# Altium project ETRX_FECU.PrjPcb
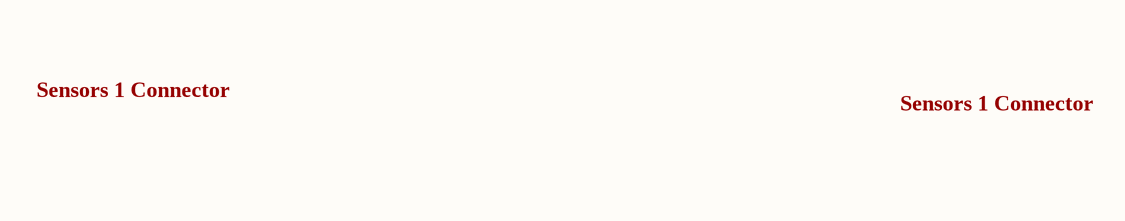
[diagram p0: ETRX_FECU.SchDoc, left]
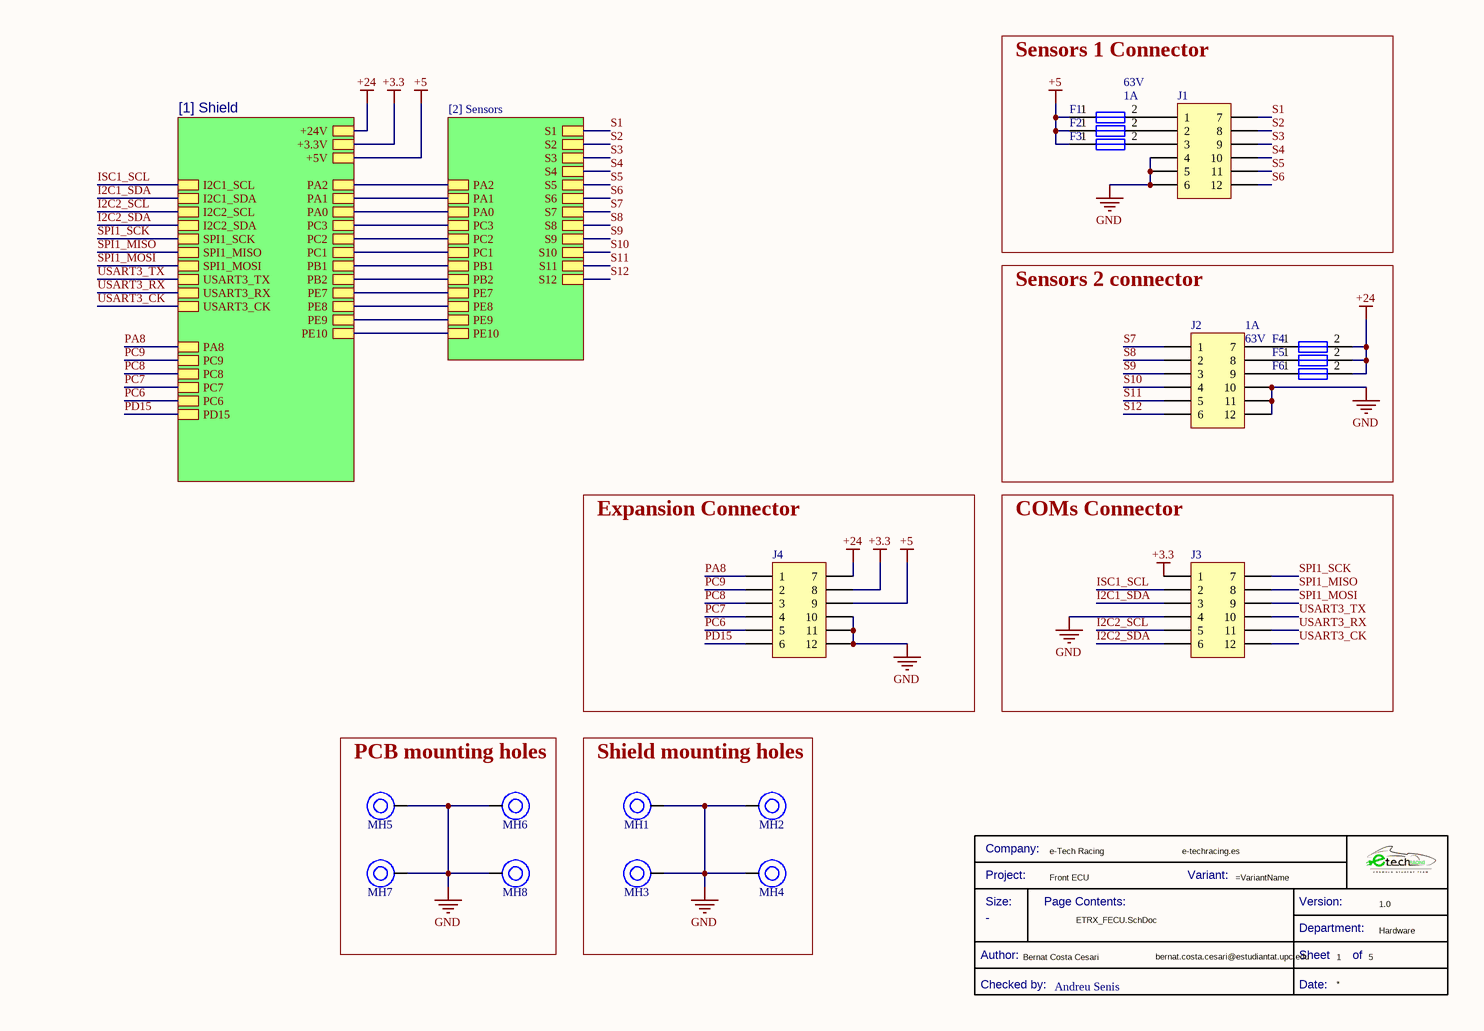
[diagram p1: ETRX_FECU.SchDoc, right]
Company: e-Tech Racing; Department: Hardware; DesignedByURL: e-techracing.es; DesignerMail: bernat.costa.cesari@estudiantat.upc.edu; DesignerName: Bernat Costa Cesari; Project: Front ECU; ReviewerName: Andreu Senis; Version: 1.0
3 sheets, 58 parts. Net scope: hierarchical (ports join the sheet entries above them; power ports are global).
Board file: ETRX_FECU.PcbDoc
Sheets:
  ETRX_FECU.SchDoc
    [1] Shield = [1] Shield.SchDoc
    [2] Sensors = [2] Sensors.SchDoc

## Sheet ETRX_FECU.SchDoc
size A4; DocumentNumber: 1; SheetNumber: 1; SheetTotal: 5

### Parts
(Parts that share a designator on the sheet are numbered #1, #2 ... from top to bottom, then left to right.)
*#1  Checked by:: Andreu Senis  (hidden comment: Title Block_template)  (graphical)
F1  Current Rating: 1A  Voltage Rating (DC): 63V  [Fuse_1206]  (hidden comment: 0437001.WRA)
F2  0437001.WRA  [Fuse_1206]  (value not drawn)
F3  0437001.WRA  [Fuse_1206]  (value not drawn)
F4  Current Rating: 1A  Voltage Rating (DC): 63V  [Fuse_1206]  (hidden comment: 0437001.WRA)
F5  0437001.WRA  [Fuse_1206]  (value not drawn)
F6  0437001.WRA  [Fuse_1206]  (value not drawn)
J1  1053101112  [J_NanoFit_2x6_V]  (value not drawn)
J2  1053101112  [J_NanoFit_2x6_V]  (value not drawn)
J3  1053101112  [J_NanoFit_2x6_V]  (value not drawn)
J4  1053101112  [J_NanoFit_2x6_V]  (value not drawn)
MH1  Mounting_Hole_M3  [Mounting_Hole_M3]  (value not drawn)
MH2  Mounting_Hole_M3  [Mounting_Hole_M3]  (value not drawn)
MH3  Mounting_Hole_M3  [Mounting_Hole_M3]  (value not drawn)
MH4  Mounting_Hole_M3  [Mounting_Hole_M3]  (value not drawn)
MH5  Mounting_Hole_M4  [Mounting_Hole_M4]  (value not drawn)
MH6  Mounting_Hole_M4  [Mounting_Hole_M4]  (value not drawn)
MH7  Mounting_Hole_M4  [Mounting_Hole_M4]  (value not drawn)
MH8  Mounting_Hole_M4  [Mounting_Hole_M4]  (value not drawn)

### Blocks framed on the sheet
Sensors 1 Connector: F1-F3 J1
Sensors 2 connector: F4-F6 J2
Expansion Connector: J4
COMs Connector: J3
PCB mounting holes: MH5-MH8
Shield mounting holes: MH1-MH4

### Sub-sheets
[1] Shield = [1] Shield: +24V, +3.3V, +5V, I2C1_SCL, I2C1_SDA, I2C2_SCL, I2C2_SDA, SPI1_SCK, SPI1_MISO, SPI1_MOSI, USART3_TX, USART3_RX, USART3_CK, PA2, PA1, PA0, PC3, PC2, PC1, PB1, PB2, PE7, PE8, PE9, PE10, PA8, PC9, PC8, PC7, PC6, PD15
[2] Sensors = [2] Sensors: PA2, PA1, PA0, PC3, PC2, PC1, PB1, PB2, PE7, PE8, PE9, PE10, S1, S2, S3, S4, S5, S6, S7, S8, S9, S10, S11, S12

### Nets
+3.3: J3.1 J4.8 ; sheet [1] Shield/+3.3V
+5: F1.1 F2.1 F3.1 J4.9 ; sheet [1] Shield/+5V
+24: F4.2 F5.2 F6.2 J4.7 ; sheet [1] Shield/+24V  [project net LV tr]
GND: J1.4 J1.5 J1.6 J2.10 J2.11 J2.12 J3.4 J4.10 J4.11 J4.12 MH1.1 MH2.1 MH3.1 MH4.1 MH5.1 MH6.1 MH7.1 MH8.1
I2C1_SDA: J3.3 ; sheet [1] Shield/I2C1_SDA
I2C2_SCL: J3.5 ; sheet [1] Shield/I2C2_SCL
I2C2_SDA: J3.6 ; sheet [1] Shield/I2C2_SDA
ISC1_SCL: J3.2 ; sheet [1] Shield/I2C1_SCL
PA0: sheet [1] Shield/PA0, sheet [2] Sensors/PA0
PA1: sheet [1] Shield/PA1, sheet [2] Sensors/PA1
PA2: sheet [1] Shield/PA2, sheet [2] Sensors/PA2
PA8: J4.1 ; sheet [1] Shield/PA8
PB1: sheet [1] Shield/PB1, sheet [2] Sensors/PB1
PB2: sheet [1] Shield/PB2, sheet [2] Sensors/PB2
PC1: sheet [1] Shield/PC1, sheet [2] Sensors/PC1
PC2: sheet [1] Shield/PC2, sheet [2] Sensors/PC2
PC3: sheet [1] Shield/PC3, sheet [2] Sensors/PC3
PC6: J4.5 ; sheet [1] Shield/PC6
PC7: J4.4 ; sheet [1] Shield/PC7
PC8: J4.3 ; sheet [1] Shield/PC8
PC9: J4.2 ; sheet [1] Shield/PC9
PD15: J4.6 ; sheet [1] Shield/PD15
PE7: sheet [1] Shield/PE7, sheet [2] Sensors/PE7
PE8: sheet [1] Shield/PE8, sheet [2] Sensors/PE8
PE9: sheet [1] Shield/PE9, sheet [2] Sensors/PE9
PE10: sheet [1] Shield/PE10, sheet [2] Sensors/PE10
S1: J1.7 ; sheet [2] Sensors/S1
S2: J1.8 ; sheet [2] Sensors/S2
S3: J1.9 ; sheet [2] Sensors/S3
S4: J1.10 ; sheet [2] Sensors/S4
S5: J1.11 ; sheet [2] Sensors/S5
S6: J1.12 ; sheet [2] Sensors/S6
S7: J2.1 ; sheet [2] Sensors/S7
S8: J2.2 ; sheet [2] Sensors/S8
S9: J2.3 ; sheet [2] Sensors/S9
S10: J2.4 ; sheet [2] Sensors/S10
S11: J2.5 ; sheet [2] Sensors/S11
S12: J2.6 ; sheet [2] Sensors/S12
SPI1_MISO: J3.8 ; sheet [1] Shield/SPI1_MISO  [project net PA6]
SPI1_MOSI: J3.9 ; sheet [1] Shield/SPI1_MOSI  [project net PA7]
SPI1_SCK: J3.7 ; sheet [1] Shield/SPI1_SCK  [project net PA5]
USART3_CK: J3.12 ; sheet [1] Shield/USART3_CK  [project net PD10]
USART3_RX: J3.11 ; sheet [1] Shield/USART3_RX  [project net PD9]
USART3_TX: J3.10 ; sheet [1] Shield/USART3_TX  [project net PD8]
NetF1_2: F1.2 J1.1
NetF2_2: F2.2 J1.2
NetF3_2: F3.2 J1.3
NetF4_1: F4.1 J2.7
NetF5_1: F5.1 J2.8
NetF6_1: F6.1 J2.9

### Notes on the sheet
- Sensors 1 Connector
- (in symbol Title Block_template) Company:; Project:; Variant:; Size:; Page Contents:; Version:; Department:; Author:; Sheet; of; Checked by:; Date:

### Library data of the parts
*#1 = Title Block_template: Standard Title Block; .Creator: GP; Category: Title Block; .PCBcheck: GP; .SCHcheck: GP; Size: -
F1-F6 = Fuse_1A_63V_1206: Fuse Chip Fast Acting 1A 63V SMD Solder Pad 1206 Ceramic T/R Automotive; Manufacturer: Littelfuse; Fuse Type: Board Mount (Cartridge Style Excluded); Approvals: CSA,cURus; .Creator: DO; Supplier 1: Digi-Key; Manufacturer Part Number: 0437001.WRA; RoHS: Yes; Category: Fuses; Stock 1: 5820; Pricing 1: 1=1,52000, 5=1,47000, 10=1,37600, 50=1,13860, 100=0,94880, 250=0,92508, 500=0,78276, 1000=0,68788 (USD); Mount: Surface Mount; Case/Package: 1206; Case Code (Imperial): 1206; Case Code (Metric): 3216; Min Operating Temperature: -55°C; Max Operating Temperature: 150°C; Packaging: Tape and Reel; Voltage Rating (AC): 63V; ComponentLink1URL: https://www.littelfuse.com/~/media/electronics/datasheets/fuses/littelfuse_fuse_437a_datasheet.pdf.pdf?src-supplier=Digi-Key; ComponentLink1Description: https://www.littelfuse.com/~/media/electronics/datasheets/fuses/littelfuse_fuse_437a_datasheet.pdf.pdf?src-supplier=Digi-Key; Supplier Part Number 1: F10001CT-ND; ComponentLink2Description: Where buy it; ComponentLink2URL: https://www.mouser.es/ProductDetail/Littelfuse/0437001WRA?qs=DXv0QSHKF4z9CJhPXjxR%252BA%3D%3D
  F2 F3 F5 F6: Current Rating: 1A; Voltage Rating (DC): 63V
J1-J4 = J_NanoFit_2x6_V: Nano-Fit Vertical Header, Through Hole, 2.50mm Pitch, Dual Row, 12 Circuits, with Kinked Pins, Tin (Sn) Plating, Black, Glow-Wire Capable, Tray

## Sheet [1] Shield.SchDoc
size A4; DocumentNumber: 2; SheetNumber: 2; SheetTotal: 5
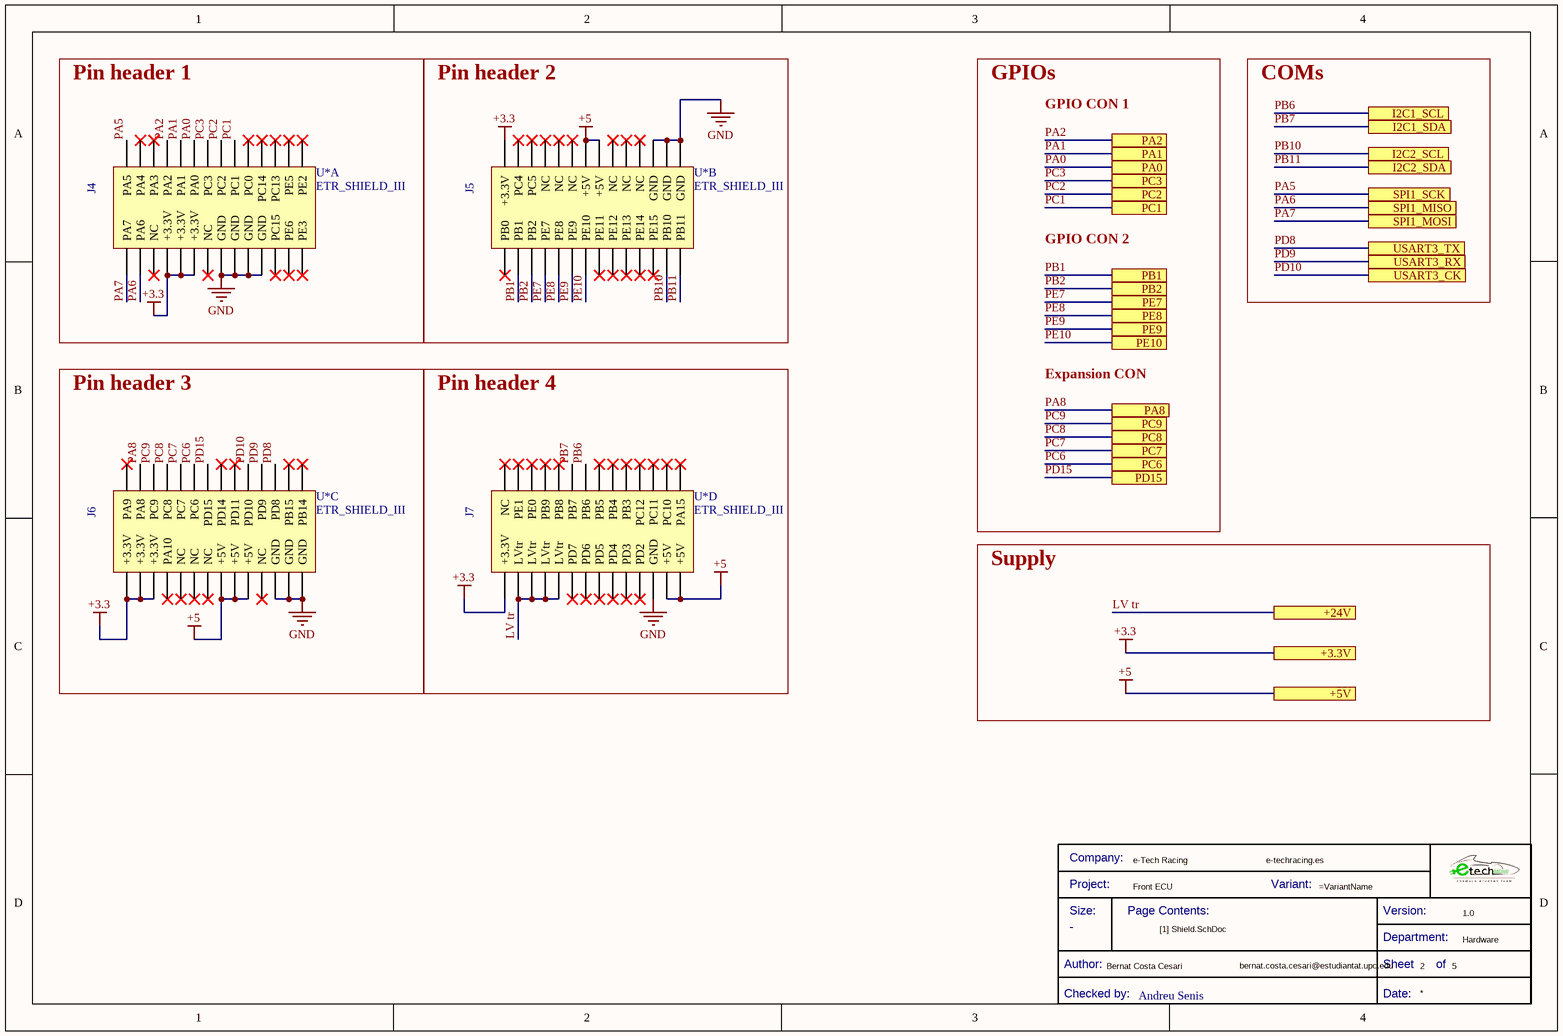
[diagram p2: [1] Shield.SchDoc]

### Parts
(Parts that share a designator on the sheet are numbered #1, #2 ... from top to bottom, then left to right.)
*#2  Checked by:: Andreu Senis  (hidden comment: Title Block_template)  (graphical)
U*  ETR_SHIELD_III  [ETR_SHIELD_III]  (parts A,B,C,D of 4)

### Blocks framed on the sheet
Pin header 1: U*
Pin header 2: U*
Pin header 3: U*
Pin header 4: U*

### Ports
+3.3V (see ETRX_FECU[2A]), +5V (see ETRX_FECU[2A]), +24V (see ETRX_FECU[2A]), I2C1_SCL (see ETRX_FECU[1A]), I2C1_SDA (see ETRX_FECU[1A]), I2C2_SCL (see ETRX_FECU[1A]), I2C2_SDA (see ETRX_FECU[1A]), PA0 (see ETRX_FECU[2A], [2] Sensors[1A]), PA1 (see ETRX_FECU[2A], [2] Sensors[1A]), PA2 (see ETRX_FECU[2A], [2] Sensors[1A]), PA8 (see ETRX_FECU[1B]), PB1 (see ETRX_FECU[2B], [2] Sensors[1A]), PB2 (see ETRX_FECU[2B], [2] Sensors[1A]), PC1 (see ETRX_FECU[2B], [2] Sensors[1A]), PC2 (see ETRX_FECU[2A], [2] Sensors[1A]), PC3 (see ETRX_FECU[2A], [2] Sensors[1A]), PC6 (see ETRX_FECU[1B]), PC7 (see ETRX_FECU[1B]), PC8 (see ETRX_FECU[1B]), PC9 (see ETRX_FECU[1B]), PD15 (see ETRX_FECU[1B]), PE7 (see ETRX_FECU[2B], [2] Sensors[1A]), PE8 (see ETRX_FECU[2B], [2] Sensors[1B]), PE9 (see ETRX_FECU[2B], [2] Sensors[1B]), PE10 (see ETRX_FECU[2B], [2] Sensors[1B]), SPI1_MISO (see ETRX_FECU[1B]), SPI1_MOSI (see ETRX_FECU[1B]), SPI1_SCK (see ETRX_FECU[1A]), USART3_CK (see ETRX_FECU[1B]), USART3_RX (see ETRX_FECU[1B]), USART3_TX (see ETRX_FECU[1B])

### Nets
+3.3: U*.3V3_1(+3.3V) U*.3V3_2(+3.3V) U*.3V3_3(+3.3V) U*.3V3_4(+3.3V) U*.3V3_5(+3.3V) U*.3V3_6(+3.3V) U*.3V3_7(+3.3V) U*.3V3_8(+3.3V) ; port +3.3V
+5: U*.5V_1(+5V) U*.5V_2(+5V) U*.5V_3(+5V) U*.5V_4(+5V) U*.5V_5(+5V) U*.5V_6(+5V) U*.5V_7(+5V) ; port +5V
GND: U*.GND_1(GND) U*.GND_2(GND) U*.GND_3(GND) U*.GND_4(GND) U*.GND_5(GND) U*.GND_6(GND) U*.GND_7(GND) U*.GND_8(GND) U*.GND_9(GND) U*.GND_10(GND) U*.GND_11(GND)
LV tr: U*.LVtr_1(LVtr) U*.LVtr_2(LVtr) U*.LVtr_3(LVtr) U*.LVtr_4(LVtr) ; port +24V
PA0: U*.PA0 ; port PA0
PA1: U*.PA1 ; port PA1
PA2: U*.PA2 ; port PA2
PA5: U*.PA5 ; port SPI1_SCK
PA6: U*.PA6 ; port SPI1_MISO
PA7: U*.PA7 ; port SPI1_MOSI
PA8: U*.PA8 ; port PA8
PB1: U*.PB1 ; port PB1
PB2: U*.PB2 ; port PB2
PB6: U*.PB6 ; port I2C1_SCL  [project net ISC1_SCL]
PB7: U*.PB7 ; port I2C1_SDA  [project net I2C1_SDA]
PB10: U*.PB10 ; port I2C2_SCL  [project net I2C2_SCL]
PB11: U*.PB11 ; port I2C2_SDA  [project net I2C2_SDA]
PC1: U*.PC1 ; port PC1
PC2: U*.PC2 ; port PC2
PC3: U*.PC3 ; port PC3
PC6: U*.PC6 ; port PC6
PC7: U*.PC7 ; port PC7
PC8: U*.PC8 ; port PC8
PC9: U*.PC9 ; port PC9
PD8: U*.PD8 ; port USART3_TX
PD9: U*.PD9 ; port USART3_RX
PD10: U*.PD10 ; port USART3_CK
PD15: U*.PD15 ; port PD15
PE7: U*.PE7 ; port PE7
PE8: U*.PE8 ; port PE8
PE9: U*.PE9 ; port PE9
PE10: U*.PE10 ; port PE10

Not connected (* = marked no-connect by the designer): U* NC_1(NC)* NC_2(NC)* NC_3(NC)* NC_4(NC)* NC_5(NC)* NC_6(NC)* NC_7(NC)* NC_8(NC)* NC_9(NC)* NC_10(NC)* NC_11(NC)* NC_12(NC)* NC_13(NC)* PA3* PA4* PA9* PA10* PA15* PB0* PB3* PB4* PB5* PB8* PB9* PB14* PB15* PC0* PC4* PC5* PC10* PC11* PC12* PC13* PC14* PC15* PD2* PD3* PD4* PD5* PD6* PD7* PD11* PD14* PE0* PE1* PE2* PE3* PE5* PE6* PE11* PE12* PE13* PE14* PE15*

### Notes on the sheet
- GPIOs
- GPIO CON 1
- COMs
- GPIO CON 2
- Expansion CON
- Supply
- (in symbol ETR_Shield_III, part A) J4
- (in symbol ETR_Shield_III, part B) J5
- (in symbol ETR_Shield_III, part C) J6
- (in symbol ETR_Shield_III, part D) J7
- (in symbol Title Block_template) Company:; Project:; Variant:; Size:; Page Contents:; Version:; Department:; Author:; Sheet; of; Checked by:; Date:

### Library data of the parts
*#2 = Title Block_template: Standard Title Block; .Creator: GP; Category: Title Block; .PCBcheck: GP; .SCHcheck: GP; Size: -

## Sheet [2] Sensors.SchDoc
size A4; DocumentNumber: 3; SheetNumber: 3; SheetTotal: 5
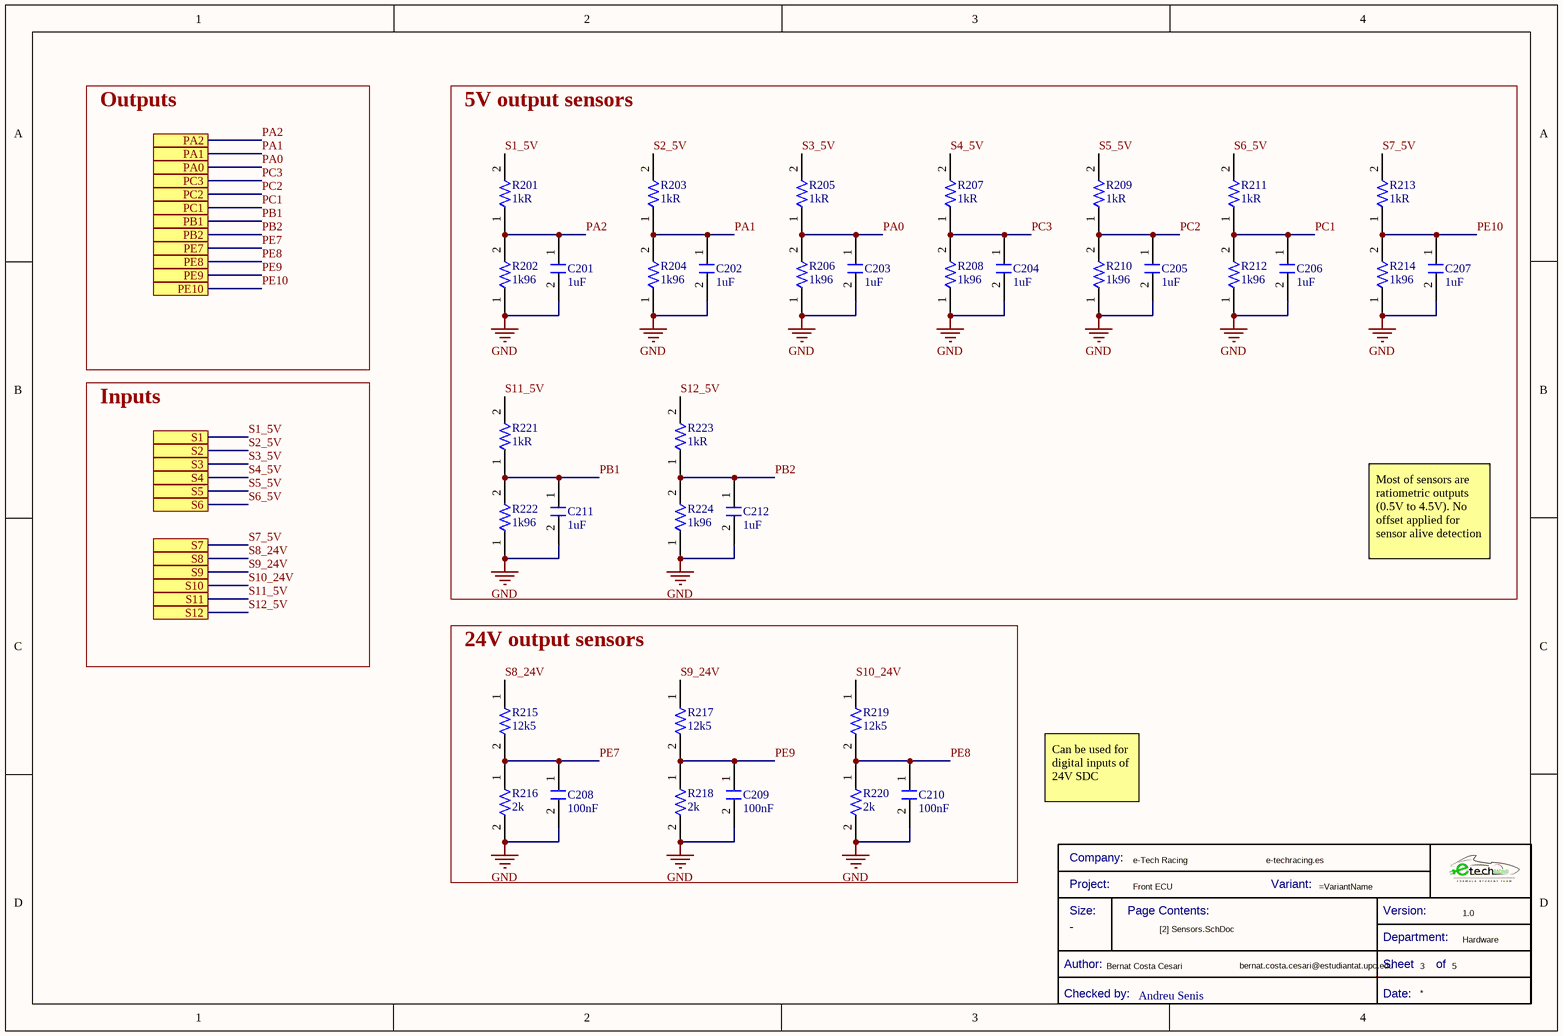
[diagram p3: [2] Sensors.SchDoc]

### Parts
(Parts that share a designator on the sheet are numbered #1, #2 ... from top to bottom, then left to right.)
*#3  Checked by:: Andreu Senis  (hidden comment: Title Block_template)  (graphical)
C201  Capacitance: 1uF  [C0805FNPC-R]  (hidden comment: 885012207103)
C202  Capacitance: 1uF  [C0805FNPC-R]  (hidden comment: 885012207103)
C203  Capacitance: 1uF  [C0805FNPC-R]  (hidden comment: 885012207103)
C204  Capacitance: 1uF  [C0805FNPC-R]  (hidden comment: 885012207103)
C205  Capacitance: 1uF  [C0805FNPC-R]  (hidden comment: 885012207103)
C206  Capacitance: 1uF  [C0805FNPC-R]  (hidden comment: 885012207103)
C207  Capacitance: 1uF  [C0805FNPC-R]  (hidden comment: 885012207103)
C208  Capacitance: 100nF  [C0805FNPC-R]  (hidden comment: 885012207098)
C209  Capacitance: 100nF  [C0805FNPC-R]  (hidden comment: 885012207098)
C210  Capacitance: 100nF  [C0805FNPC-R]  (hidden comment: 885012207098)
C211  Capacitance: 1uF  [C0805FNPC-R]  (hidden comment: 885012207103)
C212  Capacitance: 1uF  [C0805FNPC-R]  (hidden comment: 885012207103)
R201  Resistance: 1kR  [R0805FTK]  (hidden comment: CR0805-JW-102ELF)
R202  1k96  [R0805FTK]
R203  Resistance: 1kR  [R0805FTK]  (hidden comment: CR0805-JW-102ELF)
R204  1k96  [R0805FTK]
R205  Resistance: 1kR  [R0805FTK]  (hidden comment: CR0805-JW-102ELF)
R206  1k96  [R0805FTK]
R207  Resistance: 1kR  [R0805FTK]  (hidden comment: CR0805-JW-102ELF)
R208  1k96  [R0805FTK]
R209  Resistance: 1kR  [R0805FTK]  (hidden comment: CR0805-JW-102ELF)
R210  1k96  [R0805FTK]
R211  Resistance: 1kR  [R0805FTK]  (hidden comment: CR0805-JW-102ELF)
R212  1k96  [R0805FTK]
R213  Resistance: 1kR  [R0805FTK]  (hidden comment: CR0805-JW-102ELF)
R214  1k96  [R0805FTK]
R215  12k5  [R0805FTK]
R216  2k  [R0805FTK]
R217  12k5  [R0805FTK]
R218  2k  [R0805FTK]
R219  12k5  [R0805FTK]
R220  2k  [R0805FTK]
R221  Resistance: 1kR  [R0805FTK]  (hidden comment: CR0805-JW-102ELF)
R222  1k96  [R0805FTK]
R223  Resistance: 1kR  [R0805FTK]  (hidden comment: CR0805-JW-102ELF)
R224  1k96  [R0805FTK]

### Blocks framed on the sheet
5V output sensors: C201-C207 C211 C212 R201-R214 R221-R224
24V output sensors: C208-C210 R215-R220

### Ports
PA0 (see ETRX_FECU[2A], [1] Shield[3A]), PA1 (see ETRX_FECU[2A], [1] Shield[3A]), PA2 (see ETRX_FECU[2A], [1] Shield[3A]), PB1 (see ETRX_FECU[2B], [1] Shield[3B]), PB2 (see ETRX_FECU[2B], [1] Shield[3B]), PC1 (see ETRX_FECU[2B], [1] Shield[3A]), PC2 (see ETRX_FECU[2A], [1] Shield[3A]), PC3 (see ETRX_FECU[2A], [1] Shield[3A]), PE7 (see ETRX_FECU[2B], [1] Shield[3B]), PE8 (see ETRX_FECU[2B], [1] Shield[3B]), PE9 (see ETRX_FECU[2B], [1] Shield[3B]), PE10 (see ETRX_FECU[2B], [1] Shield[3B]), S1 (see ETRX_FECU[2A]), S2 (see ETRX_FECU[2A]), S3 (see ETRX_FECU[2A]), S4 (see ETRX_FECU[2A]), S5 (see ETRX_FECU[2A]), S6 (see ETRX_FECU[2A]), S7 (see ETRX_FECU[2A]), S8 (see ETRX_FECU[2A]), S9 (see ETRX_FECU[2A]), S10 (see ETRX_FECU[2B]), S11 (see ETRX_FECU[2B]), S12 (see ETRX_FECU[2B])

### Nets
GND: C201.2 C202.2 C203.2 C204.2 C205.2 C206.2 C207.2 C208.2 C209.2 C210.2 C211.2 C212.2 R202.1 R204.1 R206.1 R208.1 R210.1 R212.1 R214.1 R216.2 R218.2 R220.2 R222.1 R224.1
PA0: C203.1 R205.1 R206.2 ; port PA0
PA1: C202.1 R203.1 R204.2 ; port PA1
PA2: C201.1 R201.1 R202.2 ; port PA2
PB1: C211.1 R221.1 R222.2 ; port PB1
PB2: C212.1 R223.1 R224.2 ; port PB2
PC1: C206.1 R211.1 R212.2 ; port PC1
PC2: C205.1 R209.1 R210.2 ; port PC2
PC3: C204.1 R207.1 R208.2 ; port PC3
PE7: C208.1 R215.2 R216.1 ; port PE7
PE8: C210.1 R219.2 R220.1 ; port PE8
PE9: C209.1 R217.2 R218.1 ; port PE9
PE10: C207.1 R213.1 R214.2 ; port PE10
S1_5V: R201.2 ; port S1  [project net S1]
S2_5V: R203.2 ; port S2  [project net S2]
S3_5V: R205.2 ; port S3  [project net S3]
S4_5V: R207.2 ; port S4  [project net S4]
S5_5V: R209.2 ; port S5  [project net S5]
S6_5V: R211.2 ; port S6  [project net S6]
S7_5V: R213.2 ; port S7  [project net S7]
S8_24V: R215.1 ; port S8  [project net S8]
S9_24V: R217.1 ; port S9  [project net S9]
S10_24V: R219.1 ; port S10  [project net S10]
S11_5V: R221.2 ; port S11  [project net S11]
S12_5V: R223.2 ; port S12  [project net S12]

### Notes on the sheet
- Outputs
- Inputs
- Most of sensors are ratiometric outputs (0.5V to 4.5V). No offset applied for sensor alive detection
- Can be used for digital inputs of 24V SDC
- (in symbol Title Block_template) Company:; Project:; Variant:; Size:; Page Contents:; Version:; Department:; Author:; Sheet; of; Checked by:; Date:

### Library data of the parts
*#3 = Title Block_template: Standard Title Block; .Creator: GP; Category: Title Block; .PCBcheck: GP; .SCHcheck: GP; Size: -
C201-C207 C211 C212 = C1u-50V-0805FNPC-X7R: Multilayer Ceramic Capacitor, Wcap-Csgp Series, 1 F, 10%, X7R, 50 V, 0805 [2012 Metric] Rohs Compliant: Yes; Manufacturer 1: Wurth Electronics; Voltage Rating: 50V; .Creator: GP; Supplier 1: RSComponents; Manufacturer Part Number 1: 885012207103; RoHS: Yes; Category: Ceramic Capacitors; Stock 1: 5100; Pricing 1: 50=0,27200, 250=0,25300, 500=0,22800, 1250=0,20100, 2500=0,17100 (GBP); Mount: Surface Mount; Case/Package: 0805; Case Code (Metric): 2012; Case Code (Imperial): 0805; Min Operating Temperature: -55°C; Max Operating Temperature: 85°C; Packaging: Cut Tape; Dielectric: X7R; Tolerance: 10%; Voltage Rating (DC): 50V; Length: 0.079inch; Width: 0.049inch; Thickness: 0.053inch; REACH SVHC: Unknown; RoHS Compliant: Yes; ComponentLink1URL: http://www.farnell.com/datasheets/1958501.pdf?src-supplier=Farnell; ComponentLink1Description: http://www.farnell.com/datasheets/1958501.pdf?src-supplier=Farnell; ComponentLink2URL: http://www.farnell.com/datasheets/1958501.pdf?src-supplier=Element14; ComponentLink2Description: http://www.farnell.com/datasheets/1958501.pdf?src-supplier=Element14; ComponentLink3URL: https://katalog.we-online.de/pbs/datasheet/885012107003.pdf?src-supplier=Digi-Key; ComponentLink3Description: https://katalog.we-online.de/pbs/datasheet/885012107003.pdf?src-supplier=Digi-Key; ComponentLink4URL: http://www.farnell.com/datasheets/1958501.pdf?src-supplier=Newark; ComponentLink4Description: http://www.farnell.com/datasheets/1958501.pdf?src-supplier=Newark; Supplier Part Number 1: 1813523
C208-C210 = C100n-50V-0805FNPC-X7R: Cap, 0.1ΜF, 50V, 10%, X7R, 0805; Manufacturer 1: Wurth Electronics; .Creator: DR; Supplier 1: RSComponents; Manufacturer Part Number 1: 885012207098; RoHS: Yes; Category: Ceramic Capacitors; Stock 1: 8000; Pricing 1: 100=0,10200, 500=0,07100, 2000=0,06100 (GBP); Mount: Surface Mount; Case/Package: 0805; Case Code (Metric): 2012; Case Code (Imperial): 0805; Min Operating Temperature: -55°C; Max Operating Temperature: 125°C; Packaging: Cut Tape; Voltage Rating: 50V; Dielectric: X7R; Tolerance: 10%; Voltage Rating (DC): 50V; Length: 0.079inch; Width: 0.049inch; Thickness: 0.035inch; REACH SVHC: Unknown; RoHS Compliant: Yes; ComponentLink1URL: http://www.farnell.com/datasheets/1958498.pdf?src-supplier=Farnell; ComponentLink1Description: http://www.farnell.com/datasheets/1958498.pdf?src-supplier=Farnell; ComponentLink2URL: http://www.farnell.com/datasheets/1958498.pdf?src-supplier=Element14; ComponentLink2Description: http://www.farnell.com/datasheets/1958498.pdf?src-supplier=Element14; ComponentLink3URL: https://katalog.we-online.de/pbs/datasheet/885012207098.pdf?src-supplier=Digi-Key; ComponentLink3Description: https://katalog.we-online.de/pbs/datasheet/885012207098.pdf?src-supplier=Digi-Key; ComponentLink4URL: http://www.farnell.com/datasheets/1958498.pdf?src-supplier=Newark; ComponentLink4Description: http://www.farnell.com/datasheets/1958498.pdf?src-supplier=Newark; Supplier Part Number 1: 1813493
R201 R203 R205 R207 R209 R211 R213 R221 R223 = R1k-0805FTK: Res Thick Film 0805 1K Ohm 5% 1/8W ±200ppm/°C Molded SMD SMD Paper Tape on Plastic Reel; Manufacturer 1: Bourns; Voltage Rating (DC): 150V; Power Rating: 125mW; .Creator: GP; Supplier 1: Arrow Electronics; Manufacturer Part Number 1: CR0805-JW-102ELF; RoHS: Yes; Category: Chip SMD Resistors; Stock 1: 27510; Pricing 1: 1=0,05930, 10=0,03510, 25=0,01790, 100=0,00800, 250=0,00790, 500=0,00590, 1000=0,00360, 3000=0,00350, 6000=0,00250 (USD); Mount: Surface Mount; Case/Package: 0805; Number of Pins: 2; Contact Plating: Tin; Case Code (Metric): 2012; Case Code (Imperial): 0805; Min Operating Temperature: -55°C; Max Operating Temperature: 155°C; Resistor Type: Thick Film; Tolerance: 5%; Temperature Coefficient: 200ppm/°C; Features: Moisture Resistant; Package Quantity: 1; Packaging: Tape and Reel; Voltage Rating: 150V; Number of Terminations: 2; Termination: SMD/SMT; Max Power Dissipation: 125mW; Length: 2mm; Width: 1.25mm; Height: 0.5mm; Thickness: 508um; Depth: 1.25mm; Radiation Hardening: No; Lead Free: Lead Free; REACH SVHC: No SVHC; Military Standard: Not; ComponentLink1URL: https://datasheet.ciiva.com/11821/0900766b80fcdb72-11821134.pdf?src-supplier=RSComponents; ComponentLink1Description: https://datasheet.ciiva.com/11821/0900766b80fcdb72-11821134.pdf?src-supplier=RSComponents; ComponentLink2URL: https://datasheet.ciiva.com/15225/getdatasheetpartid-78155-15225381.pdf?src-supplier=Verical; ComponentLink2Description: https://datasheet.ciiva.com/15225/getdatasheetpartid-78155-15225381.pdf?src-supplier=Verical; ComponentLink3URL: https://datasheet.ciiva.com/22693/1902866-22693253.pdf?src-supplier=Element14; ComponentLink3Description: https://datasheet.ciiva.com/22693/1902866-22693253.pdf?src-supplier=Element14; ComponentLink4URL: https://datasheet.ciiva.com/7986/1856384-7986184.pdf?src-supplier=Element14; ComponentLink4Description: https://datasheet.ciiva.com/7986/1856384-7986184.pdf?src-supplier=Element14; ComponentLink5URL: https://datasheet.ciiva.com/7985/1856384-7985867.pdf?src-supplier=Element14; ComponentLink5Description: https://datasheet.ciiva.com/7985/1856384-7985867.pdf?src-supplier=Element14; ComponentLink6URL: https://datasheet.ciiva.com/30242/159chpreztr-30242765.pdf?src-supplier=Onlinecomponents.com; ComponentLink6Description: https://datasheet.ciiva.com/30242/159chpreztr-30242765.pdf?src-supplier=Onlinecomponents.com; ComponentLink7URL: https://datasheet.ciiva.com/6547/chpreztr-6547359.pdf?src-supplier=Digi-Key; ComponentLink7Description: https://datasheet.ciiva.com/6547/chpreztr-6547359.pdf?src-supplier=Digi-Key; Supplier Part Number 1: CR0805-JW-102ELF
R202 R204 R206 R208 R210 R212 R214 R222 R224 = R1k96-0805FTK
R215 R217 R219 = R12k5-0805FTK
R216 R218 R220 = R2k-0805FTK

## Nets that join several sheets
+3.3: ETRX_FECU (J3.1 J4.8), [1] Shield (8 pins)
+5: ETRX_FECU (F1.1 F2.1 F3.1 J4.9), [1] Shield (7 pins)
GND: ETRX_FECU (18 pins), [1] Shield (11 pins), [2] Sensors (24 pins)
LV tr: ETRX_FECU (F4.2 F5.2 F6.2 J4.7), [1] Shield (U*.LVtr_1 U*.LVtr_2 U*.LVtr_3 U*.LVtr_4)
I2C1_SDA: ETRX_FECU (J3.3), [1] Shield (U*.PB7)
I2C2_SCL: ETRX_FECU (J3.5), [1] Shield (U*.PB10)
I2C2_SDA: ETRX_FECU (J3.6), [1] Shield (U*.PB11)
ISC1_SCL: ETRX_FECU (J3.2), [1] Shield (U*.PB6)
PA0: [1] Shield (U*.PA0), [2] Sensors (C203.1 R205.1 R206.2)
PA1: [1] Shield (U*.PA1), [2] Sensors (C202.1 R203.1 R204.2)
PA2: [1] Shield (U*.PA2), [2] Sensors (C201.1 R201.1 R202.2)
PA5: ETRX_FECU (J3.7), [1] Shield (U*.PA5)
PA6: ETRX_FECU (J3.8), [1] Shield (U*.PA6)
PA7: ETRX_FECU (J3.9), [1] Shield (U*.PA7)
PA8: ETRX_FECU (J4.1), [1] Shield (U*.PA8)
PB1: [1] Shield (U*.PB1), [2] Sensors (C211.1 R221.1 R222.2)
PB2: [1] Shield (U*.PB2), [2] Sensors (C212.1 R223.1 R224.2)
PC1: [1] Shield (U*.PC1), [2] Sensors (C206.1 R211.1 R212.2)
PC2: [1] Shield (U*.PC2), [2] Sensors (C205.1 R209.1 R210.2)
PC3: [1] Shield (U*.PC3), [2] Sensors (C204.1 R207.1 R208.2)
PC6: ETRX_FECU (J4.5), [1] Shield (U*.PC6)
PC7: ETRX_FECU (J4.4), [1] Shield (U*.PC7)
PC8: ETRX_FECU (J4.3), [1] Shield (U*.PC8)
PC9: ETRX_FECU (J4.2), [1] Shield (U*.PC9)
PD8: ETRX_FECU (J3.10), [1] Shield (U*.PD8)
PD9: ETRX_FECU (J3.11), [1] Shield (U*.PD9)
PD10: ETRX_FECU (J3.12), [1] Shield (U*.PD10)
PD15: ETRX_FECU (J4.6), [1] Shield (U*.PD15)
PE7: [1] Shield (U*.PE7), [2] Sensors (C208.1 R215.2 R216.1)
PE8: [1] Shield (U*.PE8), [2] Sensors (C210.1 R219.2 R220.1)
PE9: [1] Shield (U*.PE9), [2] Sensors (C209.1 R217.2 R218.1)
PE10: [1] Shield (U*.PE10), [2] Sensors (C207.1 R213.1 R214.2)
S1: ETRX_FECU (J1.7), [2] Sensors (R201.2)
S2: ETRX_FECU (J1.8), [2] Sensors (R203.2)
S3: ETRX_FECU (J1.9), [2] Sensors (R205.2)
S4: ETRX_FECU (J1.10), [2] Sensors (R207.2)
S5: ETRX_FECU (J1.11), [2] Sensors (R209.2)
S6: ETRX_FECU (J1.12), [2] Sensors (R211.2)
S7: ETRX_FECU (J2.1), [2] Sensors (R213.2)
S8: ETRX_FECU (J2.2), [2] Sensors (R215.1)
S9: ETRX_FECU (J2.3), [2] Sensors (R217.1)
S10: ETRX_FECU (J2.4), [2] Sensors (R219.1)
S11: ETRX_FECU (J2.5), [2] Sensors (R221.2)
S12: ETRX_FECU (J2.6), [2] Sensors (R223.2)